# Altium schematic sheet 0247_GPU DECOUPLING_ VC.SchDoc
size 848 x 558 mm
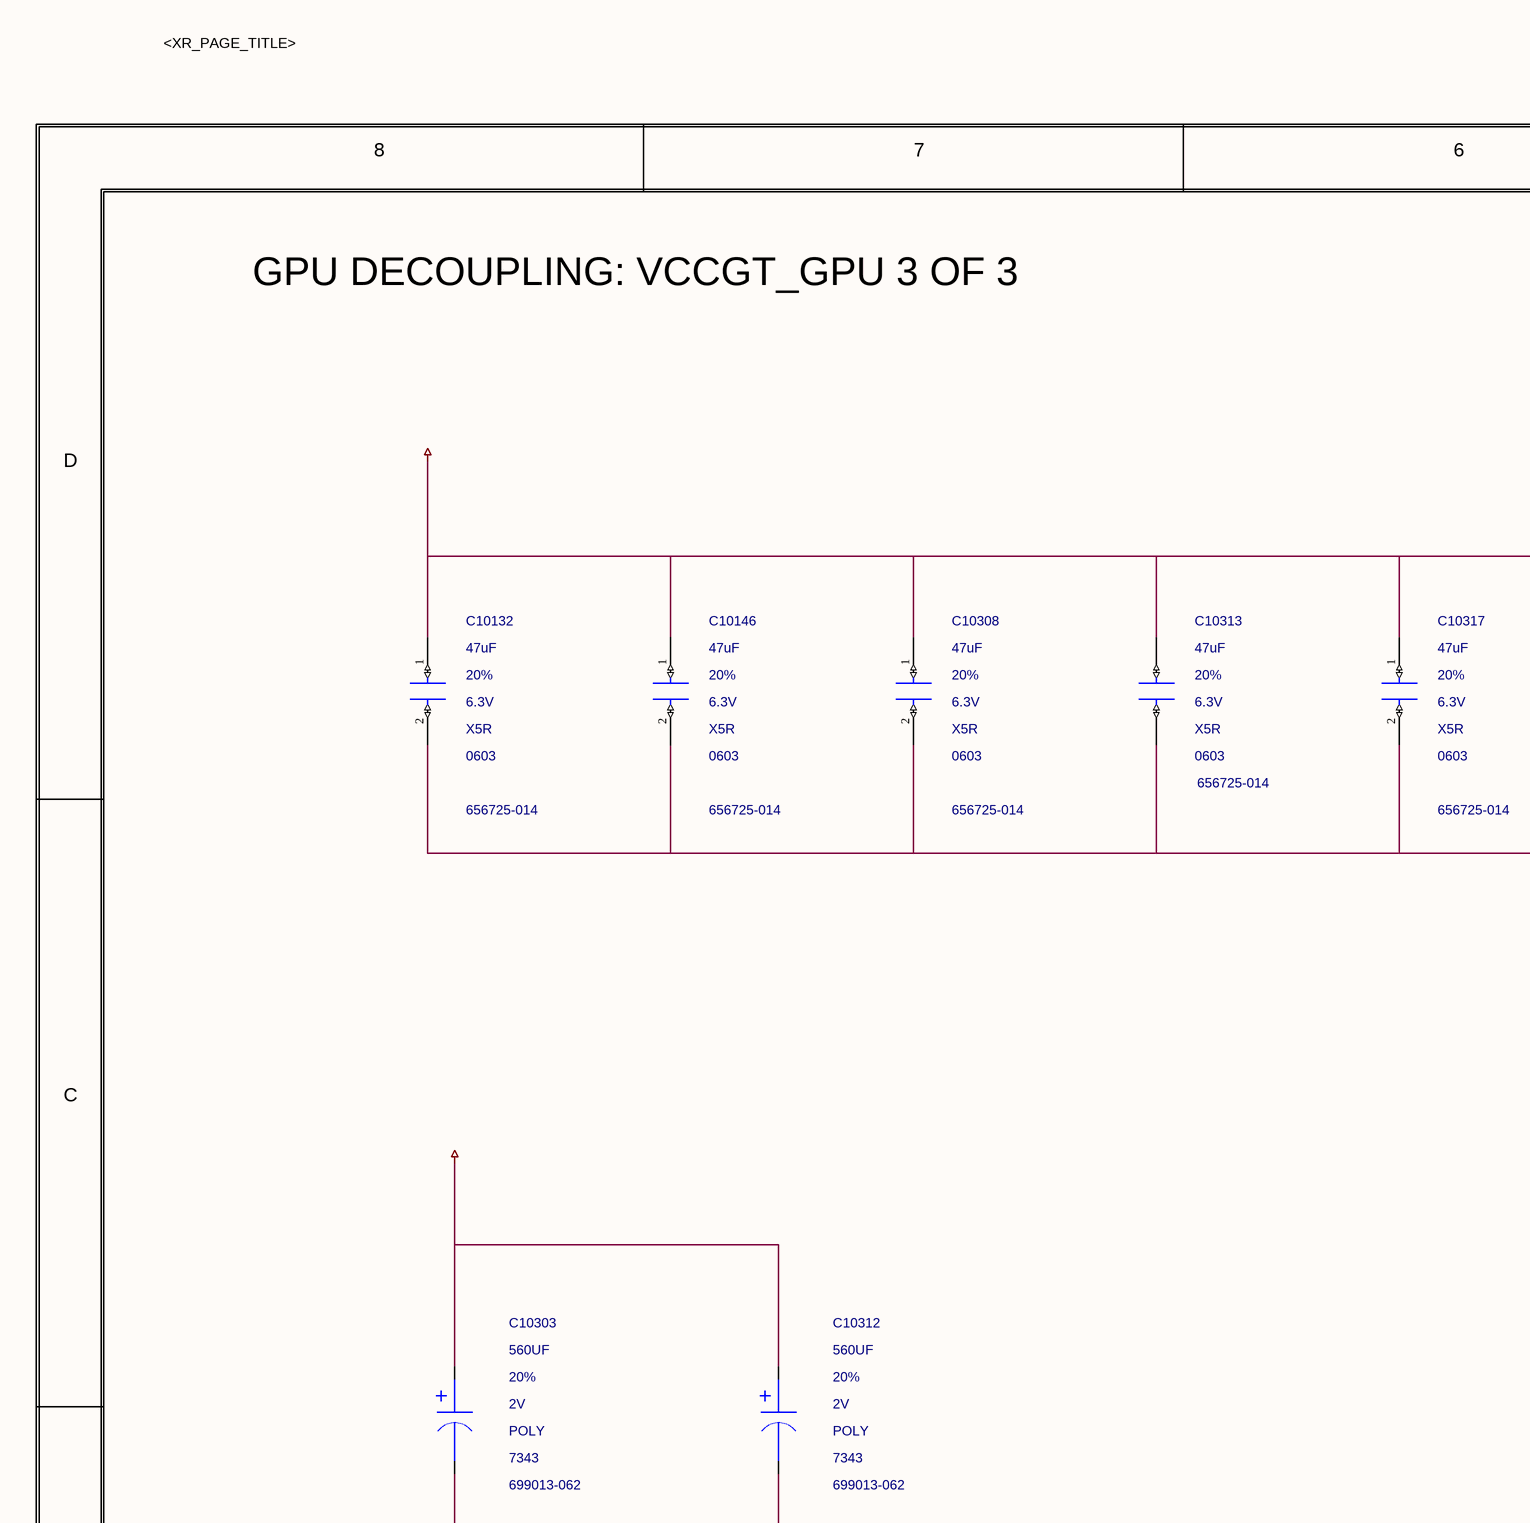
[diagram p0: 0247_GPU DECOUPLING_ VC.SchDoc, top left]
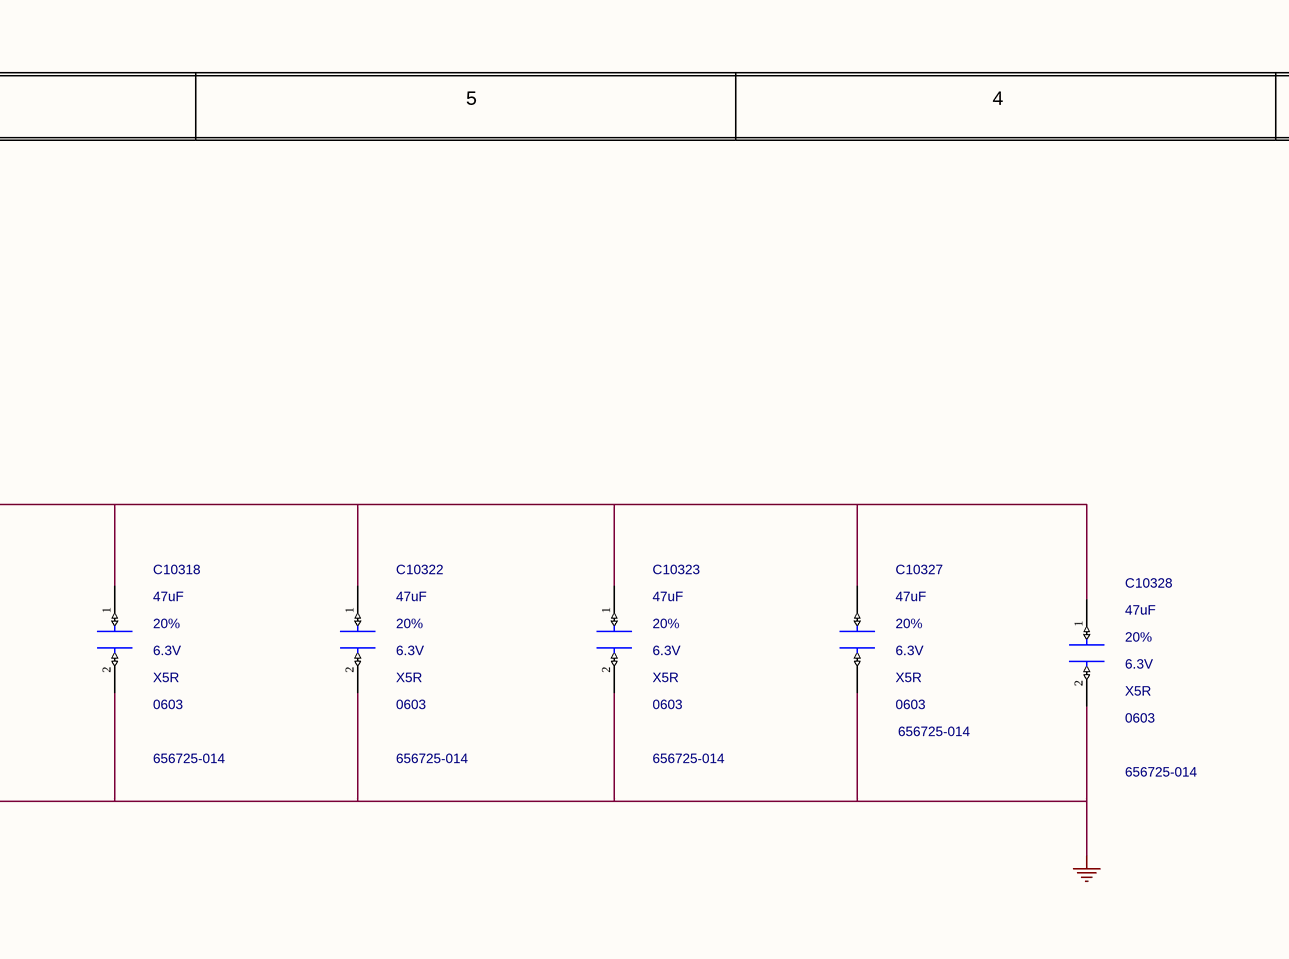
[diagram p1: 0247_GPU DECOUPLING_ VC.SchDoc, top middle]
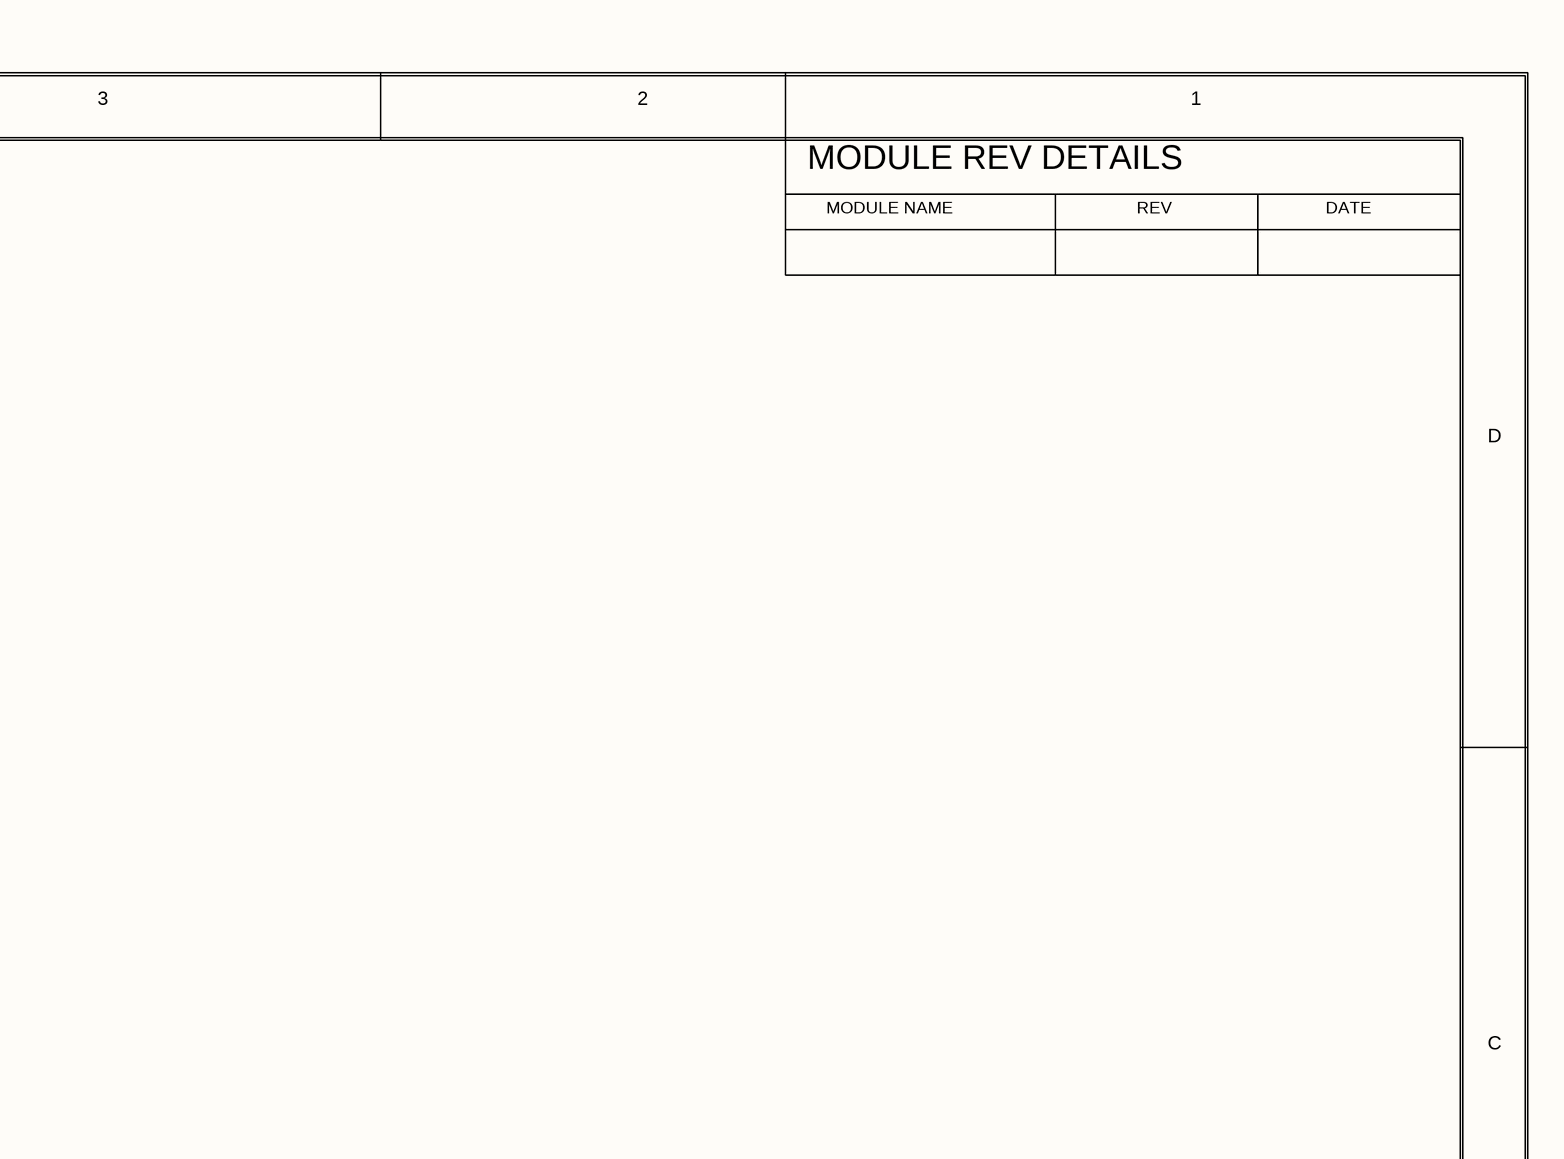
[diagram p2: 0247_GPU DECOUPLING_ VC.SchDoc, top right]
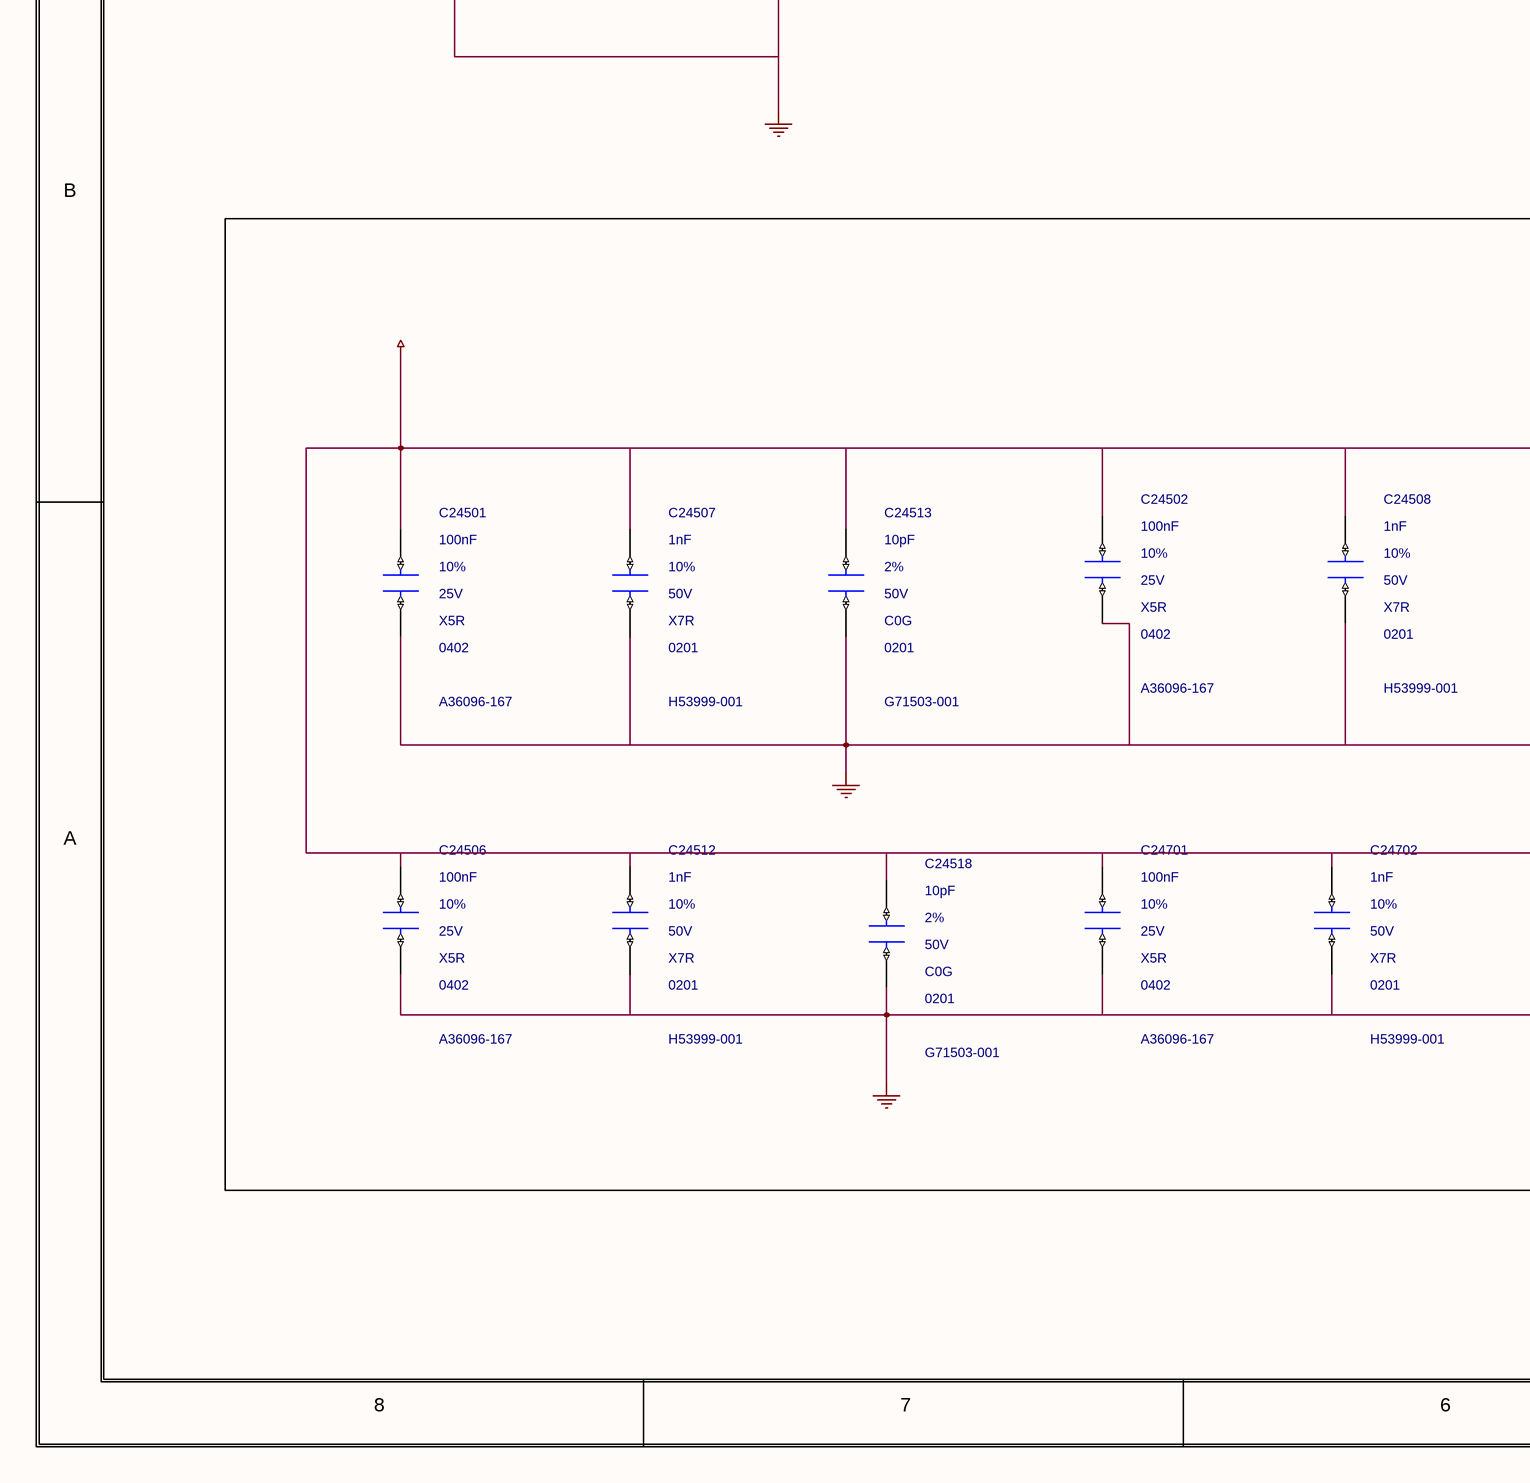
[diagram p3: 0247_GPU DECOUPLING_ VC.SchDoc, bottom left]
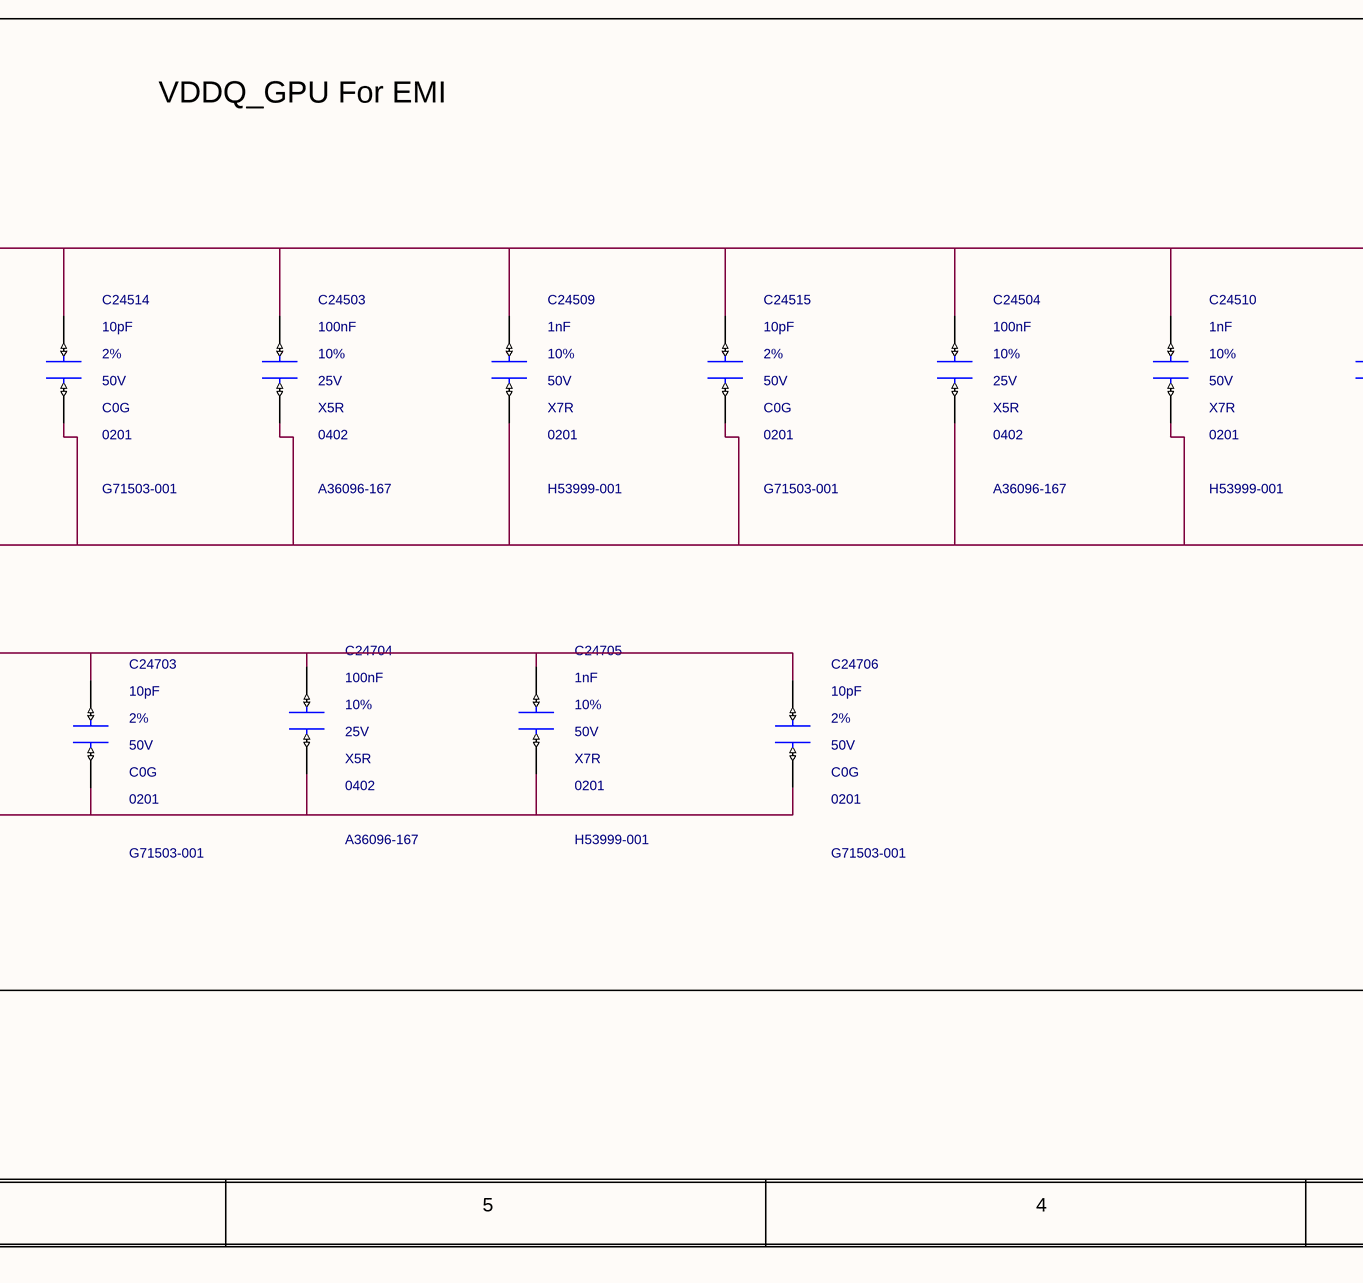
[diagram p4: 0247_GPU DECOUPLING_ VC.SchDoc, bottom middle]
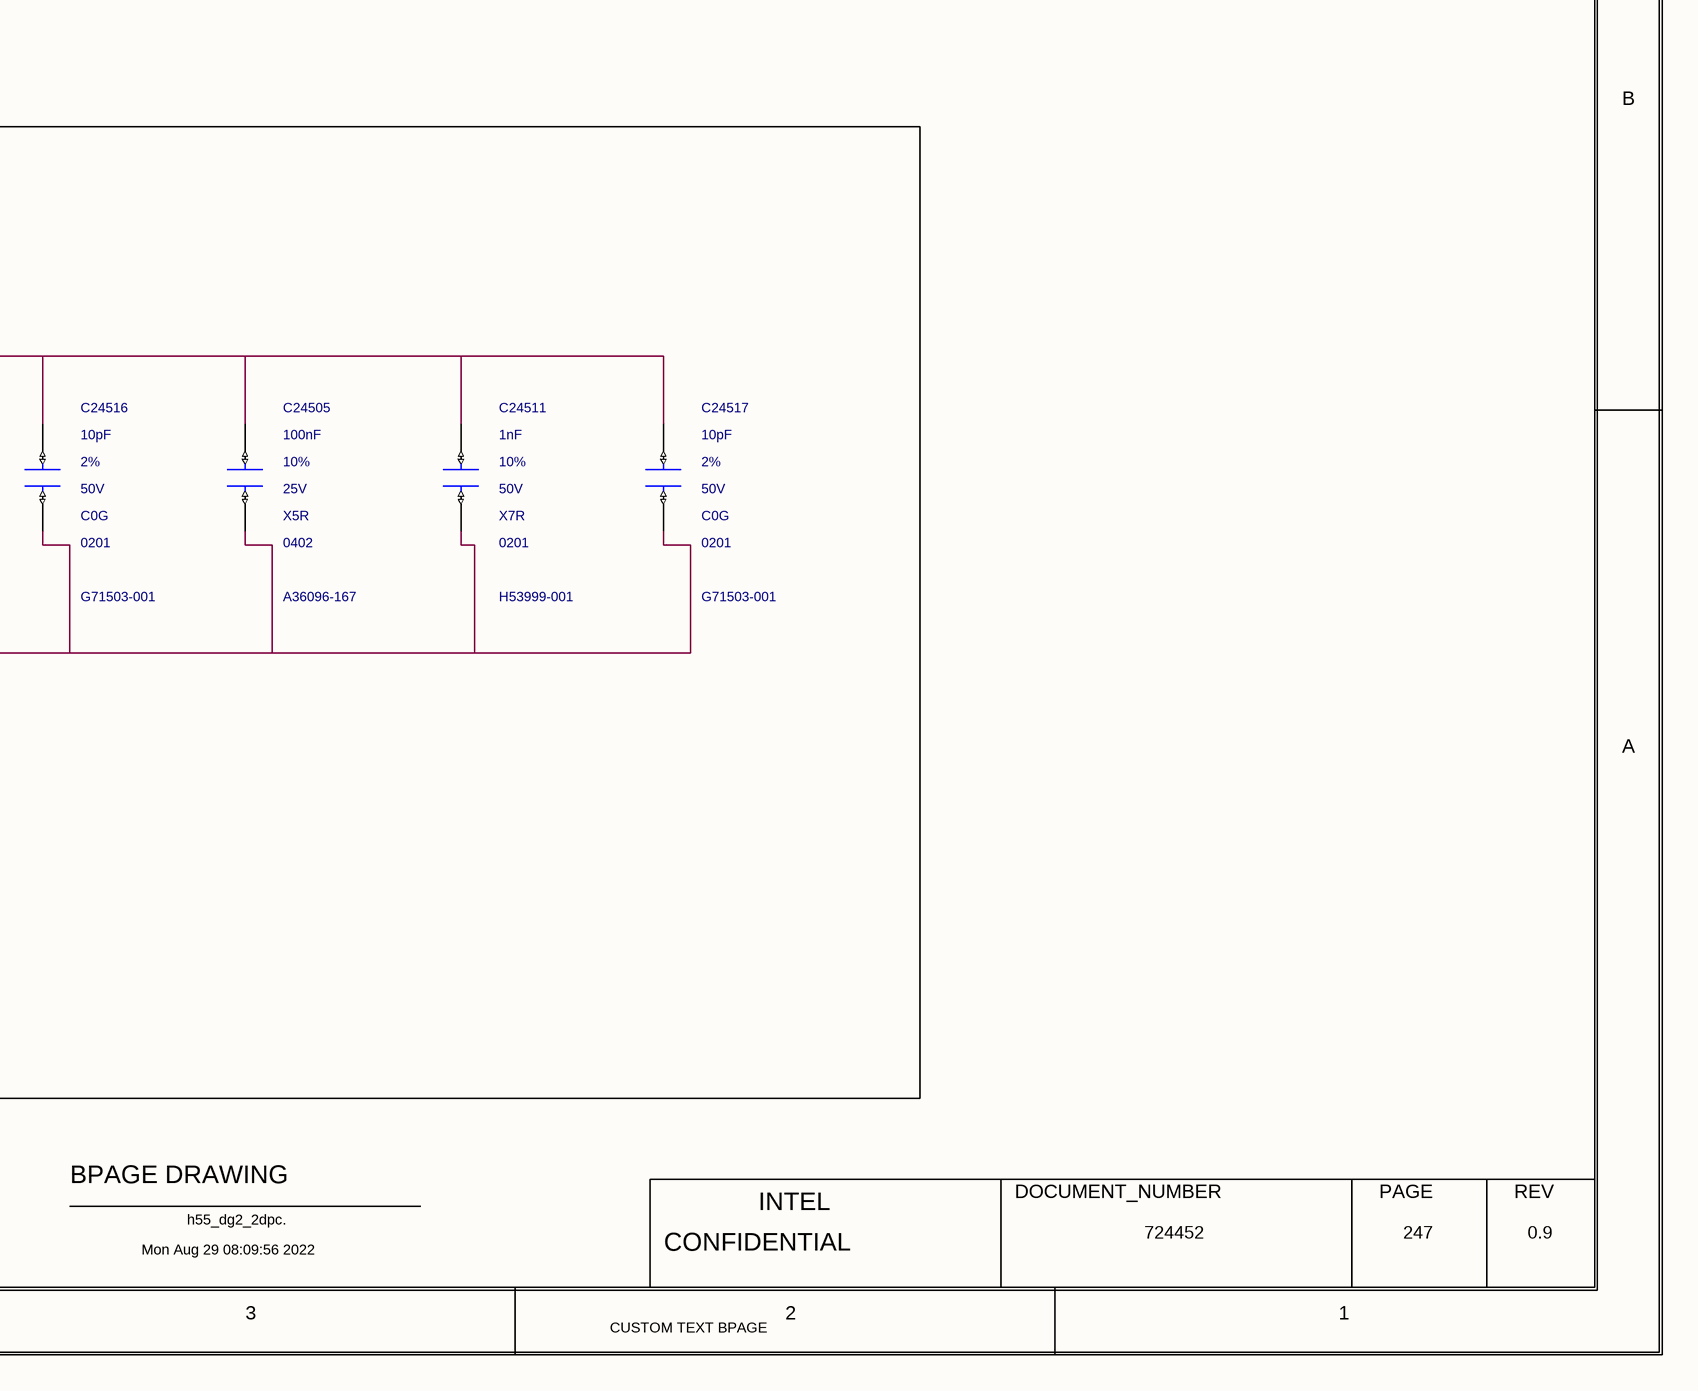
[diagram p5: 0247_GPU DECOUPLING_ VC.SchDoc, bottom right]

## Parts
C10132  47uF  MATERIAL: X5R  PACK_TYPE: 0603  PART_NUMBER: 656725-014  TOLERANCE: 20%  VOLTAGE: 6.3V  [SMC0603ID]
C10146  47uF  MATERIAL: X5R  PACK_TYPE: 0603  PART_NUMBER: 656725-014  TOLERANCE: 20%  VOLTAGE: 6.3V  [SMC0603ID]
C10303  560UF  MATERIAL: POLY  PACK_TYPE: 7343  PART_NUMBER: 699013-062  TOLERANCE: 20%  VOLTAGE: 2V  [CTK0_SMC7343M_7500X4500_TANT_MA]
C10308  47uF  MATERIAL: X5R  PACK_TYPE: 0603  PART_NUMBER: 656725-014  TOLERANCE: 20%  VOLTAGE: 6.3V  [SMC0603ID]
C10312  560UF  MATERIAL: POLY  PACK_TYPE: 7343  PART_NUMBER: 699013-062  TOLERANCE: 20%  VOLTAGE: 2V  [CTK0_SMC7343M_7500X4500_TANT_MA]
C10313  47uF  MATERIAL: X5R  PACK_TYPE: 0603  PART_NUMBER: 656725-014  TOLERANCE: 20%  VOLTAGE: 6.3V  [TK0_SM0603_1800X1000_MA]
C10317  47uF  MATERIAL: X5R  PACK_TYPE: 0603  PART_NUMBER: 656725-014  TOLERANCE: 20%  VOLTAGE: 6.3V  [SMC0603ID]
C10318  47uF  MATERIAL: X5R  PACK_TYPE: 0603  PART_NUMBER: 656725-014  TOLERANCE: 20%  VOLTAGE: 6.3V  [SMC0603ID]
C10322  47uF  MATERIAL: X5R  PACK_TYPE: 0603  PART_NUMBER: 656725-014  TOLERANCE: 20%  VOLTAGE: 6.3V  [SMC0603ID]
C10323  47uF  MATERIAL: X5R  PACK_TYPE: 0603  PART_NUMBER: 656725-014  TOLERANCE: 20%  VOLTAGE: 6.3V  [SMC0603ID]
C10327  47uF  MATERIAL: X5R  PACK_TYPE: 0603  PART_NUMBER: 656725-014  TOLERANCE: 20%  VOLTAGE: 6.3V  [TK0_SM0603_1800X1000_MA]
C10328  47uF  MATERIAL: X5R  PACK_TYPE: 0603  PART_NUMBER: 656725-014  TOLERANCE: 20%  VOLTAGE: 6.3V  [SMC0603ID]
C24501  100nF  MATERIAL: X5R  PACK_TYPE: 0402  PART_NUMBER: A36096-167  TOLERANCE: 10%  VOLTAGE: 25V  [CTK2_SM0402_1050X550_MA]
C24502  100nF  MATERIAL: X5R  PACK_TYPE: 0402  PART_NUMBER: A36096-167  TOLERANCE: 10%  VOLTAGE: 25V  [CTK2_SM0402_1050X550_MA]
C24503  100nF  MATERIAL: X5R  PACK_TYPE: 0402  PART_NUMBER: A36096-167  TOLERANCE: 10%  VOLTAGE: 25V  [CTK2_SM0402_1050X550_MA]
C24504  100nF  MATERIAL: X5R  PACK_TYPE: 0402  PART_NUMBER: A36096-167  TOLERANCE: 10%  VOLTAGE: 25V  [CTK2_SM0402_1050X550_MA]
C24505  100nF  MATERIAL: X5R  PACK_TYPE: 0402  PART_NUMBER: A36096-167  TOLERANCE: 10%  VOLTAGE: 25V  [CTK2_SM0402_1050X550_MA]
C24506  100nF  MATERIAL: X5R  PACK_TYPE: 0402  PART_NUMBER: A36096-167  TOLERANCE: 10%  VOLTAGE: 25V  [CTK2_SM0402_1050X550_MA]
C24507  1nF  MATERIAL: X7R  PACK_TYPE: 0201  PART_NUMBER: H53999-001  TOLERANCE: 10%  VOLTAGE: 50V  [CTK2_SM0201_630X330_MA]
C24508  1nF  MATERIAL: X7R  PACK_TYPE: 0201  PART_NUMBER: H53999-001  TOLERANCE: 10%  VOLTAGE: 50V  [CTK2_SM0201_630X330_MA]
C24509  1nF  MATERIAL: X7R  PACK_TYPE: 0201  PART_NUMBER: H53999-001  TOLERANCE: 10%  VOLTAGE: 50V  [CTK2_SM0201_630X330_MA]
C24510  1nF  MATERIAL: X7R  PACK_TYPE: 0201  PART_NUMBER: H53999-001  TOLERANCE: 10%  VOLTAGE: 50V  [CTK2_SM0201_630X330_MA]
C24511  1nF  MATERIAL: X7R  PACK_TYPE: 0201  PART_NUMBER: H53999-001  TOLERANCE: 10%  VOLTAGE: 50V  [CTK2_SM0201_630X330_MA]
C24512  1nF  MATERIAL: X7R  PACK_TYPE: 0201  PART_NUMBER: H53999-001  TOLERANCE: 10%  VOLTAGE: 50V  [CTK2_SM0201_630X330_MA]
C24513  10pF  MATERIAL: C0G  PACK_TYPE: 0201  PART_NUMBER: G71503-001  TOLERANCE: 2%  VOLTAGE: 50V  [CTK2_SM0201_630X330_MA]
C24514  10pF  MATERIAL: C0G  PACK_TYPE: 0201  PART_NUMBER: G71503-001  TOLERANCE: 2%  VOLTAGE: 50V  [CTK2_SM0201_630X330_MA]
C24515  10pF  MATERIAL: C0G  PACK_TYPE: 0201  PART_NUMBER: G71503-001  TOLERANCE: 2%  VOLTAGE: 50V  [CTK2_SM0201_630X330_MA]
C24516  10pF  MATERIAL: C0G  PACK_TYPE: 0201  PART_NUMBER: G71503-001  TOLERANCE: 2%  VOLTAGE: 50V  [CTK2_SM0201_630X330_MA]
C24517  10pF  MATERIAL: C0G  PACK_TYPE: 0201  PART_NUMBER: G71503-001  TOLERANCE: 2%  VOLTAGE: 50V  [CTK2_SM0201_630X330_MA]
C24518  10pF  MATERIAL: C0G  PACK_TYPE: 0201  PART_NUMBER: G71503-001  TOLERANCE: 2%  VOLTAGE: 50V  [CTK2_SM0201_630X330_MA]
C24701  100nF  MATERIAL: X5R  PACK_TYPE: 0402  PART_NUMBER: A36096-167  TOLERANCE: 10%  VOLTAGE: 25V  [CTK2_SM0402_1050X550_MA]
C24702  1nF  MATERIAL: X7R  PACK_TYPE: 0201  PART_NUMBER: H53999-001  TOLERANCE: 10%  VOLTAGE: 50V  [CTK2_SM0201_630X330_MA]
C24703  10pF  MATERIAL: C0G  PACK_TYPE: 0201  PART_NUMBER: G71503-001  TOLERANCE: 2%  VOLTAGE: 50V  [CTK2_SM0201_630X330_MA]
C24704  100nF  MATERIAL: X5R  PACK_TYPE: 0402  PART_NUMBER: A36096-167  TOLERANCE: 10%  VOLTAGE: 25V  [CTK2_SM0402_1050X550_MA]
C24705  1nF  MATERIAL: X7R  PACK_TYPE: 0201  PART_NUMBER: H53999-001  TOLERANCE: 10%  VOLTAGE: 50V  [CTK2_SM0201_630X330_MA]
C24706  10pF  MATERIAL: C0G  PACK_TYPE: 0201  PART_NUMBER: G71503-001  TOLERANCE: 2%  VOLTAGE: 50V  [CTK2_SM0201_630X330_MA]

## Blocks framed on the sheet
VDDQ_GPU For EMI: C24501-C24518 C24701-C24706

## Nets
+VCCGT_GPU: C10132.1(A) C10146.1(A) C10303.1(A) C10308.1(A) C10312.1(A) C10313.1(A) C10317.1(A) C10318.1(A) C10322.1(A) C10323.1(A) C10327.1(A) C10328.1(A)
+VDDQ_GPU: C24501.1(A) C24502.1(A) C24503.1(A) C24504.1(A) C24505.1(A) C24506.1(A) C24507.1(A) C24508.1(A) C24509.1(A) C24510.1(A) C24511.1(A) C24512.1(A) C24513.1(A) C24514.1(A) C24515.1(A) C24516.1(A) C24517.1(A) C24518.1(A) C24701.1(A) C24702.1(A) C24703.1(A) C24704.1(A) C24705.1(A) C24706.1(A)
GND: C10132.2(B) C10146.2(B) C10303.2(B) C10308.2(B) C10312.2(B) C10313.2(B) C10317.2(B) C10318.2(B) C10322.2(B) C10323.2(B) C10327.2(B) C10328.2(B) C24501.2(B) C24502.2(B) C24503.2(B) C24504.2(B) C24505.2(B) C24506.2(B) C24507.2(B) C24508.2(B) C24509.2(B) C24510.2(B) C24511.2(B) C24512.2(B) C24513.2(B) C24514.2(B) C24515.2(B) C24516.2(B) C24517.2(B) C24518.2(B) C24701.2(B) C24702.2(B) C24703.2(B) C24704.2(B) C24705.2(B) C24706.2(B)

## Notes on the sheet
- <XR_PAGE_TITLE>
- 8
- 7
- 6
- 5
- 4
- 3
- 2
- 1
- MODULE REV DETAILS
- GPU DECOUPLING: VCCGT_GPU 3 OF 3
- MODULE NAME
- REV
- DATE
- D
- C
- B
- A
- BPAGE DRAWING
- INTEL
- DOCUMENT_NUMBER
- PAGE
- Mon Aug 29 08:09:56 2022
- h55_dg2_2dpc.
- CONFIDENTIAL
- 724452
- 247
- 0.9
- CUSTOM TEXT BPAGE

## Library data of the parts
C10132 = CAP: CDS_PHYS_PART_NAME: CAP_0603-656725-014,X5R,47UF,6.3V,20%,LPDB,GENERIC; OriginalSymbolOrigin: (-50,25); XY: (-2050,2900); VER: 1; ROT: 0; PHYS_PAGE: 247; LOCATION: C10132; DRAWING: @RVP1_ADL_SB_ADP_S_DDR5_SODIMM_2DPC_LIB.H55_DG2_2DPC(SCH_1):PAGE418; CDS_LIB: discrete; PCB Footprint: SMC0603ID; CHIPS_PART_NAME: CAP; CDS_PART_NAME: CAP_0603-656725-014,X5R,47UF,6.3V,20%,LPDB,GENERIC; CDS_LOCATION: C10132
C10146 = CAP: CDS_PHYS_PART_NAME: CAP_0603-656725-014,X5R,47UF,6.3V,20%,LPDB,GENERIC; OriginalSymbolOrigin: (-50,25); XY: (-1600,2900); VER: 1; ROT: 0; PHYS_PAGE: 247; LOCATION: C10146; DRAWING: @RVP1_ADL_SB_ADP_S_DDR5_SODIMM_2DPC_LIB.H55_DG2_2DPC(SCH_1):PAGE418; CDS_LIB: discrete; PCB Footprint: SMC0603ID; CHIPS_PART_NAME: CAP; CDS_PART_NAME: CAP_0603-656725-014,X5R,47UF,6.3V,20%,LPDB,GENERIC; CDS_LOCATION: C10146
C10303 = C_CAPP: CDS_PHYS_PART_NAME: C_CAPP_7343-699013-062,POLY,560UF,2V,20%,TK0,GENERIC; CDS_LMAN_SYM_OUTLINE: -50,100,50,-50; FP_TECH: TK0; IP: GENERIC; ROOM: NONE; OriginalSymbolOrigin: (-50,75); XY: (-2000,1550); VER: 1; ROT: 0; PHYS_PAGE: 247; LOCATION: C10303; DRAWING: @RVP1_ADL_SB_ADP_S_DDR5_SODIMM_2DPC_LIB.H55_DG2_2DPC(SCH_1):PAGE418; CDS_LIB: c_discrete; VARIANT: ?; PCB Footprint: CTK0_SMC7343M_7500X4500_TANT_MA; CHIPS_PART_NAME: C_CAPP; CDS_PART_NAME: C_CAPP_7343-699013-062,POLY,560UF,2V,20%,TK0,GENERIC; CDS_LOCATION: C10303
C10308 = CAP: CDS_PHYS_PART_NAME: CAP_0603-656725-014,X5R,47UF,6.3V,20%,LPDB,GENERIC; OriginalSymbolOrigin: (-50,25); XY: (-1150,2900); VER: 1; ROT: 0; PHYS_PAGE: 247; LOCATION: C10308; DRAWING: @RVP1_ADL_SB_ADP_S_DDR5_SODIMM_2DPC_LIB.H55_DG2_2DPC(SCH_1):PAGE418; CDS_LIB: discrete; PCB Footprint: SMC0603ID; CHIPS_PART_NAME: CAP; CDS_PART_NAME: CAP_0603-656725-014,X5R,47UF,6.3V,20%,LPDB,GENERIC; CDS_LOCATION: C10308
C10312 = C_CAPP: CDS_PHYS_PART_NAME: C_CAPP_7343-699013-062,POLY,560UF,2V,20%,TK0,GENERIC; CDS_LMAN_SYM_OUTLINE: -50,100,50,-50; FP_TECH: TK0; IP: GENERIC; ROOM: NONE; OriginalSymbolOrigin: (-50,75); XY: (-1400,1550); VER: 1; ROT: 0; PHYS_PAGE: 247; LOCATION: C10312; DRAWING: @RVP1_ADL_SB_ADP_S_DDR5_SODIMM_2DPC_LIB.H55_DG2_2DPC(SCH_1):PAGE418; CDS_LIB: c_discrete; VARIANT: ?; PCB Footprint: CTK0_SMC7343M_7500X4500_TANT_MA; CHIPS_PART_NAME: C_CAPP; CDS_PART_NAME: C_CAPP_7343-699013-062,POLY,560UF,2V,20%,TK0,GENERIC; CDS_LOCATION: C10312
C10313 = CAP_2: CDS_PHYS_PART_NAME: CAP_2_0603-656725-014,X5R,47UF,6.3V,20%,TK0,GENERIC; BOM_USE: STUFF; CDS_LMAN_SYM_OUTLINE: -50,50,50,-50; FP_TECH: TK0; IP: GENERIC; ROOM: NONE; OriginalSymbolOrigin: (-50,25); XY: (-700,2900); VER: 1; ROT: 0; PHYS_PAGE: 247; LOCATION: C10313; DRAWING: @RVP1_ADL_SB_ADP_S_DDR5_SODIMM_2DPC_LIB.H55_DG2_2DPC(SCH_1):PAGE418; CDS_LIB: discrete_2; VARIANT: ?; PCB Footprint: TK0_SM0603_1800X1000_MA; CHIPS_PART_NAME: CAP_2; CDS_PART_NAME: CAP_2_0603-656725-014,X5R,47UF,6.3V,20%,TK0,GENERIC; CDS_LOCATION: C10313
C10317 = CAP: CDS_PHYS_PART_NAME: CAP_0603-656725-014,X5R,47UF,6.3V,20%,LPDB,GENERIC; OriginalSymbolOrigin: (-50,25); XY: (-250,2900); VER: 1; ROT: 0; PHYS_PAGE: 247; LOCATION: C10317; DRAWING: @RVP1_ADL_SB_ADP_S_DDR5_SODIMM_2DPC_LIB.H55_DG2_2DPC(SCH_1):PAGE418; CDS_LIB: discrete; PCB Footprint: SMC0603ID; CHIPS_PART_NAME: CAP; CDS_PART_NAME: CAP_0603-656725-014,X5R,47UF,6.3V,20%,LPDB,GENERIC; CDS_LOCATION: C10317
C10318 = CAP: CDS_PHYS_PART_NAME: CAP_0603-656725-014,X5R,47UF,6.3V,20%,LPDB,GENERIC; OriginalSymbolOrigin: (-50,25); XY: (200,2900); VER: 1; ROT: 0; PHYS_PAGE: 247; LOCATION: C10318; DRAWING: @RVP1_ADL_SB_ADP_S_DDR5_SODIMM_2DPC_LIB.H55_DG2_2DPC(SCH_1):PAGE418; CDS_LIB: discrete; PCB Footprint: SMC0603ID; CHIPS_PART_NAME: CAP; CDS_PART_NAME: CAP_0603-656725-014,X5R,47UF,6.3V,20%,LPDB,GENERIC; CDS_LOCATION: C10318
C10322 = CAP: CDS_PHYS_PART_NAME: CAP_0603-656725-014,X5R,47UF,6.3V,20%,LPDB,GENERIC; OriginalSymbolOrigin: (-50,25); XY: (650,2900); VER: 1; ROT: 0; PHYS_PAGE: 247; LOCATION: C10322; DRAWING: @RVP1_ADL_SB_ADP_S_DDR5_SODIMM_2DPC_LIB.H55_DG2_2DPC(SCH_1):PAGE418; CDS_LIB: discrete; PCB Footprint: SMC0603ID; CHIPS_PART_NAME: CAP; CDS_PART_NAME: CAP_0603-656725-014,X5R,47UF,6.3V,20%,LPDB,GENERIC; CDS_LOCATION: C10322
C10323 = CAP: CDS_PHYS_PART_NAME: CAP_0603-656725-014,X5R,47UF,6.3V,20%,LPDB,GENERIC; OriginalSymbolOrigin: (-50,25); XY: (1125,2900); VER: 1; ROT: 0; PHYS_PAGE: 247; LOCATION: C10323; DRAWING: @RVP1_ADL_SB_ADP_S_DDR5_SODIMM_2DPC_LIB.H55_DG2_2DPC(SCH_1):PAGE418; CDS_LIB: discrete; PCB Footprint: SMC0603ID; CHIPS_PART_NAME: CAP; CDS_PART_NAME: CAP_0603-656725-014,X5R,47UF,6.3V,20%,LPDB,GENERIC; CDS_LOCATION: C10323
C10327 = CAP_2: CDS_PHYS_PART_NAME: CAP_2_0603-656725-014,X5R,47UF,6.3V,20%,TK0,GENERIC; BOM_USE: STUFF; CDS_LMAN_SYM_OUTLINE: -50,50,50,-50; FP_TECH: TK0; IP: GENERIC; ROOM: NONE; OriginalSymbolOrigin: (-50,25); XY: (1575,2900); VER: 1; ROT: 0; PHYS_PAGE: 247; LOCATION: C10327; DRAWING: @RVP1_ADL_SB_ADP_S_DDR5_SODIMM_2DPC_LIB.H55_DG2_2DPC(SCH_1):PAGE418; CDS_LIB: discrete_2; VARIANT: ?; PCB Footprint: TK0_SM0603_1800X1000_MA; CHIPS_PART_NAME: CAP_2; CDS_PART_NAME: CAP_2_0603-656725-014,X5R,47UF,6.3V,20%,TK0,GENERIC; CDS_LOCATION: C10327
C10328 = CAP: CDS_PHYS_PART_NAME: CAP_0603-656725-014,X5R,47UF,6.3V,20%,LPDB,GENERIC; OriginalSymbolOrigin: (-50,25); XY: (2000,2875); VER: 1; ROT: 0; PHYS_PAGE: 247; LOCATION: C10328; DRAWING: @RVP1_ADL_SB_ADP_S_DDR5_SODIMM_2DPC_LIB.H55_DG2_2DPC(SCH_1):PAGE418; CDS_LIB: discrete; PCB Footprint: SMC0603ID; CHIPS_PART_NAME: CAP; CDS_PART_NAME: CAP_0603-656725-014,X5R,47UF,6.3V,20%,LPDB,GENERIC; CDS_LOCATION: C10328
C24501 = C_CAP: CDS_PHYS_PART_NAME: C_CAP_0402-A36096-167,X5R,100NF,25V,10%,TK2,GENERIC; CDS_LMAN_SYM_OUTLINE: -50,50,50,-50; FP_TECH: TK2; IP: GENERIC; ROOM: NONE; OriginalSymbolOrigin: (-50,25); XY: (-2100,300); VER: 1; ROT: 0; PHYS_PAGE: 247; LOCATION: C24501; DRAWING: @RVP1_ADL_SB_ADP_S_DDR5_SODIMM_2DPC_LIB.H55_DG2_2DPC(SCH_1):PAGE418; CDS_LIB: c_discrete; VARIANT: ?; PCB Footprint: CTK2_SM0402_1050X550_MA; CHIPS_PART_NAME: C_CAP; CDS_PART_NAME: C_CAP_0402-A36096-167,X5R,100NF,25V,10%,TK2,GENERIC; CDS_LOCATION: C24501
C24502 = C_CAP: CDS_PHYS_PART_NAME: C_CAP_0402-A36096-167,X5R,100NF,25V,10%,TK2,GENERIC; CDS_LMAN_SYM_OUTLINE: -50,50,50,-50; FP_TECH: TK2; IP: GENERIC; ROOM: NONE; OriginalSymbolOrigin: (-50,25); XY: (-800,325); VER: 1; ROT: 0; PHYS_PAGE: 247; LOCATION: C24502; DRAWING: @RVP1_ADL_SB_ADP_S_DDR5_SODIMM_2DPC_LIB.H55_DG2_2DPC(SCH_1):PAGE418; CDS_LIB: c_discrete; VARIANT: ?; PCB Footprint: CTK2_SM0402_1050X550_MA; CHIPS_PART_NAME: C_CAP; CDS_PART_NAME: C_CAP_0402-A36096-167,X5R,100NF,25V,10%,TK2,GENERIC; CDS_LOCATION: C24502
C24503 = C_CAP: CDS_PHYS_PART_NAME: C_CAP_0402-A36096-167,X5R,100NF,25V,10%,TK2,GENERIC; CDS_LMAN_SYM_OUTLINE: -50,50,50,-50; FP_TECH: TK2; IP: GENERIC; ROOM: NONE; OriginalSymbolOrigin: (-50,25); XY: (450,325); VER: 1; ROT: 0; PHYS_PAGE: 247; LOCATION: C24503; DRAWING: @RVP1_ADL_SB_ADP_S_DDR5_SODIMM_2DPC_LIB.H55_DG2_2DPC(SCH_1):PAGE418; CDS_LIB: c_discrete; VARIANT: ?; PCB Footprint: CTK2_SM0402_1050X550_MA; CHIPS_PART_NAME: C_CAP; CDS_PART_NAME: C_CAP_0402-A36096-167,X5R,100NF,25V,10%,TK2,GENERIC; CDS_LOCATION: C24503
C24504 = C_CAP: CDS_PHYS_PART_NAME: C_CAP_0402-A36096-167,X5R,100NF,25V,10%,TK2,GENERIC; CDS_LMAN_SYM_OUTLINE: -50,50,50,-50; FP_TECH: TK2; IP: GENERIC; ROOM: NONE; OriginalSymbolOrigin: (-50,25); XY: (1700,325); VER: 1; ROT: 0; PHYS_PAGE: 247; LOCATION: C24504; DRAWING: @RVP1_ADL_SB_ADP_S_DDR5_SODIMM_2DPC_LIB.H55_DG2_2DPC(SCH_1):PAGE418; CDS_LIB: c_discrete; VARIANT: ?; PCB Footprint: CTK2_SM0402_1050X550_MA; CHIPS_PART_NAME: C_CAP; CDS_PART_NAME: C_CAP_0402-A36096-167,X5R,100NF,25V,10%,TK2,GENERIC; CDS_LOCATION: C24504
C24505 = C_CAP: CDS_PHYS_PART_NAME: C_CAP_0402-A36096-167,X5R,100NF,25V,10%,TK2,GENERIC; CDS_LMAN_SYM_OUTLINE: -50,50,50,-50; FP_TECH: TK2; IP: GENERIC; ROOM: NONE; OriginalSymbolOrigin: (-50,25); XY: (2850,325); VER: 1; ROT: 0; PHYS_PAGE: 247; LOCATION: C24505; DRAWING: @RVP1_ADL_SB_ADP_S_DDR5_SODIMM_2DPC_LIB.H55_DG2_2DPC(SCH_1):PAGE418; CDS_LIB: c_discrete; VARIANT: ?; PCB Footprint: CTK2_SM0402_1050X550_MA; CHIPS_PART_NAME: C_CAP; CDS_PART_NAME: C_CAP_0402-A36096-167,X5R,100NF,25V,10%,TK2,GENERIC; CDS_LOCATION: C24505
C24506 = C_CAP: CDS_PHYS_PART_NAME: C_CAP_0402-A36096-167,X5R,100NF,25V,10%,TK2,GENERIC; CDS_LMAN_SYM_OUTLINE: -50,50,50,-50; FP_TECH: TK2; IP: GENERIC; ROOM: NONE; OriginalSymbolOrigin: (-50,25); XY: (-2100,-325); VER: 1; ROT: 0; PHYS_PAGE: 247; LOCATION: C24506; DRAWING: @RVP1_ADL_SB_ADP_S_DDR5_SODIMM_2DPC_LIB.H55_DG2_2DPC(SCH_1):PAGE418; CDS_LIB: c_discrete; VARIANT: ?; PCB Footprint: CTK2_SM0402_1050X550_MA; CHIPS_PART_NAME: C_CAP; CDS_PART_NAME: C_CAP_0402-A36096-167,X5R,100NF,25V,10%,TK2,GENERIC; CDS_LOCATION: C24506
C24507 = C_CAP: CDS_PHYS_PART_NAME: C_CAP_0201-H53999-001,X7R,1NF,50V,10%,TK2,GENERIC; CDS_LMAN_SYM_OUTLINE: -50,50,50,-50; FP_TECH: TK2; IP: GENERIC; ROOM: NONE; OriginalSymbolOrigin: (-50,25); XY: (-1675,300); VER: 1; ROT: 0; PHYS_PAGE: 247; LOCATION: C24507; DRAWING: @RVP1_ADL_SB_ADP_S_DDR5_SODIMM_2DPC_LIB.H55_DG2_2DPC(SCH_1):PAGE418; CDS_LIB: c_discrete; VARIANT: ?; PCB Footprint: CTK2_SM0201_630X330_MA; CHIPS_PART_NAME: C_CAP; CDS_PART_NAME: C_CAP_0201-H53999-001,X7R,1NF,50V,10%,TK2,GENERIC; CDS_LOCATION: C24507
C24508 = C_CAP: CDS_PHYS_PART_NAME: C_CAP_0201-H53999-001,X7R,1NF,50V,10%,TK2,GENERIC; CDS_LMAN_SYM_OUTLINE: -50,50,50,-50; FP_TECH: TK2; IP: GENERIC; ROOM: NONE; OriginalSymbolOrigin: (-50,25); XY: (-350,325); VER: 1; ROT: 0; PHYS_PAGE: 247; LOCATION: C24508; DRAWING: @RVP1_ADL_SB_ADP_S_DDR5_SODIMM_2DPC_LIB.H55_DG2_2DPC(SCH_1):PAGE418; CDS_LIB: c_discrete; VARIANT: ?; PCB Footprint: CTK2_SM0201_630X330_MA; CHIPS_PART_NAME: C_CAP; CDS_PART_NAME: C_CAP_0201-H53999-001,X7R,1NF,50V,10%,TK2,GENERIC; CDS_LOCATION: C24508
C24509 = C_CAP: CDS_PHYS_PART_NAME: C_CAP_0201-H53999-001,X7R,1NF,50V,10%,TK2,GENERIC; CDS_LMAN_SYM_OUTLINE: -50,50,50,-50; FP_TECH: TK2; IP: GENERIC; ROOM: NONE; OriginalSymbolOrigin: (-50,25); XY: (875,325); VER: 1; ROT: 0; PHYS_PAGE: 247; LOCATION: C24509; DRAWING: @RVP1_ADL_SB_ADP_S_DDR5_SODIMM_2DPC_LIB.H55_DG2_2DPC(SCH_1):PAGE418; CDS_LIB: c_discrete; VARIANT: ?; PCB Footprint: CTK2_SM0201_630X330_MA; CHIPS_PART_NAME: C_CAP; CDS_PART_NAME: C_CAP_0201-H53999-001,X7R,1NF,50V,10%,TK2,GENERIC; CDS_LOCATION: C24509
C24510 = C_CAP: CDS_PHYS_PART_NAME: C_CAP_0201-H53999-001,X7R,1NF,50V,10%,TK2,GENERIC; CDS_LMAN_SYM_OUTLINE: -50,50,50,-50; FP_TECH: TK2; IP: GENERIC; ROOM: NONE; OriginalSymbolOrigin: (-50,25); XY: (2100,325); VER: 1; ROT: 0; PHYS_PAGE: 247; LOCATION: C24510; DRAWING: @RVP1_ADL_SB_ADP_S_DDR5_SODIMM_2DPC_LIB.H55_DG2_2DPC(SCH_1):PAGE418; CDS_LIB: c_discrete; VARIANT: ?; PCB Footprint: CTK2_SM0201_630X330_MA; CHIPS_PART_NAME: C_CAP; CDS_PART_NAME: C_CAP_0201-H53999-001,X7R,1NF,50V,10%,TK2,GENERIC; CDS_LOCATION: C24510
C24511 = C_CAP: CDS_PHYS_PART_NAME: C_CAP_0201-H53999-001,X7R,1NF,50V,10%,TK2,GENERIC; CDS_LMAN_SYM_OUTLINE: -50,50,50,-50; FP_TECH: TK2; IP: GENERIC; ROOM: NONE; OriginalSymbolOrigin: (-50,25); XY: (3250,325); VER: 1; ROT: 0; PHYS_PAGE: 247; LOCATION: C24511; DRAWING: @RVP1_ADL_SB_ADP_S_DDR5_SODIMM_2DPC_LIB.H55_DG2_2DPC(SCH_1):PAGE418; CDS_LIB: c_discrete; VARIANT: ?; PCB Footprint: CTK2_SM0201_630X330_MA; CHIPS_PART_NAME: C_CAP; CDS_PART_NAME: C_CAP_0201-H53999-001,X7R,1NF,50V,10%,TK2,GENERIC; CDS_LOCATION: C24511
C24512 = C_CAP: CDS_PHYS_PART_NAME: C_CAP_0201-H53999-001,X7R,1NF,50V,10%,TK2,GENERIC; CDS_LMAN_SYM_OUTLINE: -50,50,50,-50; FP_TECH: TK2; IP: GENERIC; ROOM: NONE; OriginalSymbolOrigin: (-50,25); XY: (-1675,-325); VER: 1; ROT: 0; PHYS_PAGE: 247; LOCATION: C24512; DRAWING: @RVP1_ADL_SB_ADP_S_DDR5_SODIMM_2DPC_LIB.H55_DG2_2DPC(SCH_1):PAGE418; CDS_LIB: c_discrete; VARIANT: ?; PCB Footprint: CTK2_SM0201_630X330_MA; CHIPS_PART_NAME: C_CAP; CDS_PART_NAME: C_CAP_0201-H53999-001,X7R,1NF,50V,10%,TK2,GENERIC; CDS_LOCATION: C24512
C24513 = C_CAP: CDS_PHYS_PART_NAME: C_CAP_0201-G71503-001,C0G,10PF,50V,2%,TK2,GENERIC; CDS_LMAN_SYM_OUTLINE: -50,50,50,-50; FP_TECH: TK2; IP: GENERIC; ROOM: NONE; OriginalSymbolOrigin: (-50,25); XY: (-1275,300); VER: 1; ROT: 0; PHYS_PAGE: 247; LOCATION: C24513; DRAWING: @RVP1_ADL_SB_ADP_S_DDR5_SODIMM_2DPC_LIB.H55_DG2_2DPC(SCH_1):PAGE418; CDS_LIB: c_discrete; VARIANT: ?; PCB Footprint: CTK2_SM0201_630X330_MA; CHIPS_PART_NAME: C_CAP; CDS_PART_NAME: C_CAP_0201-G71503-001,C0G,10PF,50V,2%,TK2,GENERIC; CDS_LOCATION: C24513
C24514 = C_CAP: CDS_PHYS_PART_NAME: C_CAP_0201-G71503-001,C0G,10PF,50V,2%,TK2,GENERIC; CDS_LMAN_SYM_OUTLINE: -50,50,50,-50; FP_TECH: TK2; IP: GENERIC; ROOM: NONE; OriginalSymbolOrigin: (-50,25); XY: (50,325); VER: 1; ROT: 0; PHYS_PAGE: 247; LOCATION: C24514; DRAWING: @RVP1_ADL_SB_ADP_S_DDR5_SODIMM_2DPC_LIB.H55_DG2_2DPC(SCH_1):PAGE418; CDS_LIB: c_discrete; VARIANT: ?; PCB Footprint: CTK2_SM0201_630X330_MA; CHIPS_PART_NAME: C_CAP; CDS_PART_NAME: C_CAP_0201-G71503-001,C0G,10PF,50V,2%,TK2,GENERIC; CDS_LOCATION: C24514
C24515 = C_CAP: CDS_PHYS_PART_NAME: C_CAP_0201-G71503-001,C0G,10PF,50V,2%,TK2,GENERIC; CDS_LMAN_SYM_OUTLINE: -50,50,50,-50; FP_TECH: TK2; IP: GENERIC; ROOM: NONE; OriginalSymbolOrigin: (-50,25); XY: (1275,325); VER: 1; ROT: 0; PHYS_PAGE: 247; LOCATION: C24515; DRAWING: @RVP1_ADL_SB_ADP_S_DDR5_SODIMM_2DPC_LIB.H55_DG2_2DPC(SCH_1):PAGE418; CDS_LIB: c_discrete; VARIANT: ?; PCB Footprint: CTK2_SM0201_630X330_MA; CHIPS_PART_NAME: C_CAP; CDS_PART_NAME: C_CAP_0201-G71503-001,C0G,10PF,50V,2%,TK2,GENERIC; CDS_LOCATION: C24515
C24516 = C_CAP: CDS_PHYS_PART_NAME: C_CAP_0201-G71503-001,C0G,10PF,50V,2%,TK2,GENERIC; CDS_LMAN_SYM_OUTLINE: -50,50,50,-50; FP_TECH: TK2; IP: GENERIC; ROOM: NONE; OriginalSymbolOrigin: (-50,25); XY: (2475,325); VER: 1; ROT: 0; PHYS_PAGE: 247; LOCATION: C24516; DRAWING: @RVP1_ADL_SB_ADP_S_DDR5_SODIMM_2DPC_LIB.H55_DG2_2DPC(SCH_1):PAGE418; CDS_LIB: c_discrete; VARIANT: ?; PCB Footprint: CTK2_SM0201_630X330_MA; CHIPS_PART_NAME: C_CAP; CDS_PART_NAME: C_CAP_0201-G71503-001,C0G,10PF,50V,2%,TK2,GENERIC; CDS_LOCATION: C24516
C24517 = C_CAP: CDS_PHYS_PART_NAME: C_CAP_0201-G71503-001,C0G,10PF,50V,2%,TK2,GENERIC; CDS_LMAN_SYM_OUTLINE: -50,50,50,-50; FP_TECH: TK2; IP: GENERIC; ROOM: NONE; OriginalSymbolOrigin: (-50,25); XY: (3625,325); VER: 1; ROT: 0; PHYS_PAGE: 247; LOCATION: C24517; DRAWING: @RVP1_ADL_SB_ADP_S_DDR5_SODIMM_2DPC_LIB.H55_DG2_2DPC(SCH_1):PAGE418; CDS_LIB: c_discrete; VARIANT: ?; PCB Footprint: CTK2_SM0201_630X330_MA; CHIPS_PART_NAME: C_CAP; CDS_PART_NAME: C_CAP_0201-G71503-001,C0G,10PF,50V,2%,TK2,GENERIC; CDS_LOCATION: C24517
C24518 = C_CAP: CDS_PHYS_PART_NAME: C_CAP_0201-G71503-001,C0G,10PF,50V,2%,TK2,GENERIC; CDS_LMAN_SYM_OUTLINE: -50,50,50,-50; FP_TECH: TK2; IP: GENERIC; ROOM: NONE; OriginalSymbolOrigin: (-50,25); XY: (-1200,-350); VER: 1; ROT: 0; PHYS_PAGE: 247; LOCATION: C24518; DRAWING: @RVP1_ADL_SB_ADP_S_DDR5_SODIMM_2DPC_LIB.H55_DG2_2DPC(SCH_1):PAGE418; CDS_LIB: c_discrete; VARIANT: ?; PCB Footprint: CTK2_SM0201_630X330_MA; CHIPS_PART_NAME: C_CAP; CDS_PART_NAME: C_CAP_0201-G71503-001,C0G,10PF,50V,2%,TK2,GENERIC; CDS_LOCATION: C24518
C24701 = C_CAP: CDS_PHYS_PART_NAME: C_CAP_0402-A36096-167,X5R,100NF,25V,10%,TK2,GENERIC; CDS_LMAN_SYM_OUTLINE: -50,50,50,-50; FP_TECH: TK2; IP: GENERIC; ROOM: NONE; OriginalSymbolOrigin: (-50,25); XY: (-800,-325); VER: 1; ROT: 0; PHYS_PAGE: 247; LOCATION: C24701; DRAWING: @RVP1_ADL_SB_ADP_S_DDR5_SODIMM_2DPC_LIB.H55_DG2_2DPC(SCH_1):PAGE418; CDS_LIB: c_discrete; VARIANT: ?; PCB Footprint: CTK2_SM0402_1050X550_MA; CHIPS_PART_NAME: C_CAP; CDS_PART_NAME: C_CAP_0402-A36096-167,X5R,100NF,25V,10%,TK2,GENERIC; CDS_LOCATION: C24701
C24702 = C_CAP: CDS_PHYS_PART_NAME: C_CAP_0201-H53999-001,X7R,1NF,50V,10%,TK2,GENERIC; CDS_LMAN_SYM_OUTLINE: -50,50,50,-50; FP_TECH: TK2; IP: GENERIC; ROOM: NONE; OriginalSymbolOrigin: (-50,25); XY: (-375,-325); VER: 1; ROT: 0; PHYS_PAGE: 247; LOCATION: C24702; DRAWING: @RVP1_ADL_SB_ADP_S_DDR5_SODIMM_2DPC_LIB.H55_DG2_2DPC(SCH_1):PAGE418; CDS_LIB: c_discrete; VARIANT: ?; PCB Footprint: CTK2_SM0201_630X330_MA; CHIPS_PART_NAME: C_CAP; CDS_PART_NAME: C_CAP_0201-H53999-001,X7R,1NF,50V,10%,TK2,GENERIC; CDS_LOCATION: C24702
C24703 = C_CAP: CDS_PHYS_PART_NAME: C_CAP_0201-G71503-001,C0G,10PF,50V,2%,TK2,GENERIC; CDS_LMAN_SYM_OUTLINE: -50,50,50,-50; FP_TECH: TK2; IP: GENERIC; ROOM: NONE; OriginalSymbolOrigin: (-50,25); XY: (100,-350); VER: 1; ROT: 0; PHYS_PAGE: 247; LOCATION: C24703; DRAWING: @RVP1_ADL_SB_ADP_S_DDR5_SODIMM_2DPC_LIB.H55_DG2_2DPC(SCH_1):PAGE418; CDS_LIB: c_discrete; VARIANT: ?; PCB Footprint: CTK2_SM0201_630X330_MA; CHIPS_PART_NAME: C_CAP; CDS_PART_NAME: C_CAP_0201-G71503-001,C0G,10PF,50V,2%,TK2,GENERIC; CDS_LOCATION: C24703
C24704 = C_CAP: CDS_PHYS_PART_NAME: C_CAP_0402-A36096-167,X5R,100NF,25V,10%,TK2,GENERIC; CDS_LMAN_SYM_OUTLINE: -50,50,50,-50; FP_TECH: TK2; IP: GENERIC; ROOM: NONE; OriginalSymbolOrigin: (-50,25); XY: (500,-325); VER: 1; ROT: 0; PHYS_PAGE: 247; LOCATION: C24704; DRAWING: @RVP1_ADL_SB_ADP_S_DDR5_SODIMM_2DPC_LIB.H55_DG2_2DPC(SCH_1):PAGE418; CDS_LIB: c_discrete; VARIANT: ?; PCB Footprint: CTK2_SM0402_1050X550_MA; CHIPS_PART_NAME: C_CAP; CDS_PART_NAME: C_CAP_0402-A36096-167,X5R,100NF,25V,10%,TK2,GENERIC; CDS_LOCATION: C24704
C24705 = C_CAP: CDS_PHYS_PART_NAME: C_CAP_0201-H53999-001,X7R,1NF,50V,10%,TK2,GENERIC; CDS_LMAN_SYM_OUTLINE: -50,50,50,-50; FP_TECH: TK2; IP: GENERIC; ROOM: NONE; OriginalSymbolOrigin: (-50,25); XY: (925,-325); VER: 1; ROT: 0; PHYS_PAGE: 247; LOCATION: C24705; DRAWING: @RVP1_ADL_SB_ADP_S_DDR5_SODIMM_2DPC_LIB.H55_DG2_2DPC(SCH_1):PAGE418; CDS_LIB: c_discrete; VARIANT: ?; PCB Footprint: CTK2_SM0201_630X330_MA; CHIPS_PART_NAME: C_CAP; CDS_PART_NAME: C_CAP_0201-H53999-001,X7R,1NF,50V,10%,TK2,GENERIC; CDS_LOCATION: C24705
C24706 = C_CAP: CDS_PHYS_PART_NAME: C_CAP_0201-G71503-001,C0G,10PF,50V,2%,TK2,GENERIC; CDS_LMAN_SYM_OUTLINE: -50,50,50,-50; FP_TECH: TK2; IP: GENERIC; ROOM: NONE; OriginalSymbolOrigin: (-50,25); XY: (1400,-350); VER: 1; ROT: 0; PHYS_PAGE: 247; LOCATION: C24706; DRAWING: @RVP1_ADL_SB_ADP_S_DDR5_SODIMM_2DPC_LIB.H55_DG2_2DPC(SCH_1):PAGE418; CDS_LIB: c_discrete; VARIANT: ?; PCB Footprint: CTK2_SM0201_630X330_MA; CHIPS_PART_NAME: C_CAP; CDS_PART_NAME: C_CAP_0201-G71503-001,C0G,10PF,50V,2%,TK2,GENERIC; CDS_LOCATION: C24706